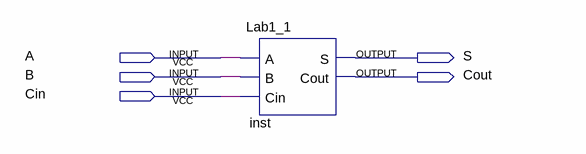
[diagram p0: schematic sheet]
// Quartus schematic Lab1_1_1.bdf as structural Verilog: 1 symbols, 5 pins
module Lab1_1_1 (
  input  A,
  input  B,
  input  Cin,
  output S,
  output Cout
);

  Lab1_1 inst (.A(A), .B(B), .Cin(Cin), .S(S), .Cout(Cout));
endmodule
